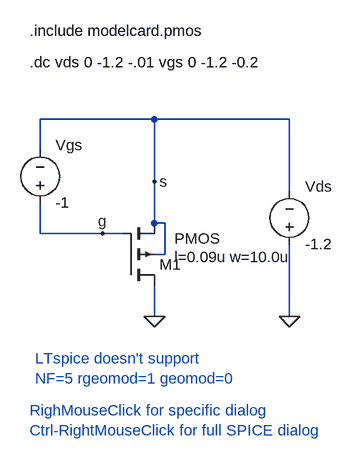
[diagram p0: schematic pmos_sweep.asc]
pmos_sweep.asc, the LTspice schematic file:
Version 4
SHEET 1 880 680
WIRE 208 -64 32 -64
WIRE 416 -64 208 -64
WIRE 32 -16 32 -64
WIRE 208 32 208 -64
WIRE 416 48 416 -64
WIRE 208 96 208 32
WIRE 224 96 208 96
WIRE 32 112 32 64
WIRE 128 112 32 112
WIRE 160 112 128 112
WIRE 224 144 224 96
WIRE 224 144 208 144
WIRE 208 240 208 192
WIRE 416 240 416 128
FLAG 208 240 0
FLAG 416 240 0
FLAG 128 112 g
FLAG 208 32 s
SYMBOL pmos4 160 192 M180
WINDOW 3 79 72 Left 0
WINDOW 123 79 44 Left 0
SYMATTR InstName M1
SYMATTR Value2 l=0.09u w=10.0u
SYMBOL voltage 416 144 M180
WINDOW 0 24 104 Left 0
WINDOW 3 24 16 Left 0
SYMATTR InstName Vds
SYMATTR Value -1.2
SYMBOL voltage 32 80 M180
WINDOW 0 24 104 Left 0
WINDOW 3 24 16 Left 0
SYMATTR InstName Vgs
SYMATTR Value -1
TEXT 16 -152 Left 0 !.dc vds 0 -1.2 -.01 vgs 0 -1.2 -0.2
TEXT 16 -200 Left 0 !.include modelcard.pmos
TEXT 24 304 Left 0 ;LTspice doesn't support\nNF=5 rgeomod=1 geomod=0
TEXT 16 384 Left 0 ;RighMouseClick for specific dialog\nCtrl-RightMouseClick for full SPICE dialog

The netlist it stands for:
* pmos_sweep.asc
M1 0 g s s PMOS l=0.09u w=10.0u
Vds 0 s -1.2
Vgs g s -1
.model NMOS NMOS
.model PMOS PMOS
.lib standard.mos
.dc vds 0 -1.2 -.01 vgs 0 -1.2 -0.2
.include modelcard.pmos
* LTspice doesn't support
* NF=5 rgeomod=1 geomod=0
* RighMouseClick for specific dialog
* Ctrl-RightMouseClick for full SPICE dialog
.backanno
.end